# EAGLE schematic DHJSNoiseConsole (EAGLE 7.2.0)
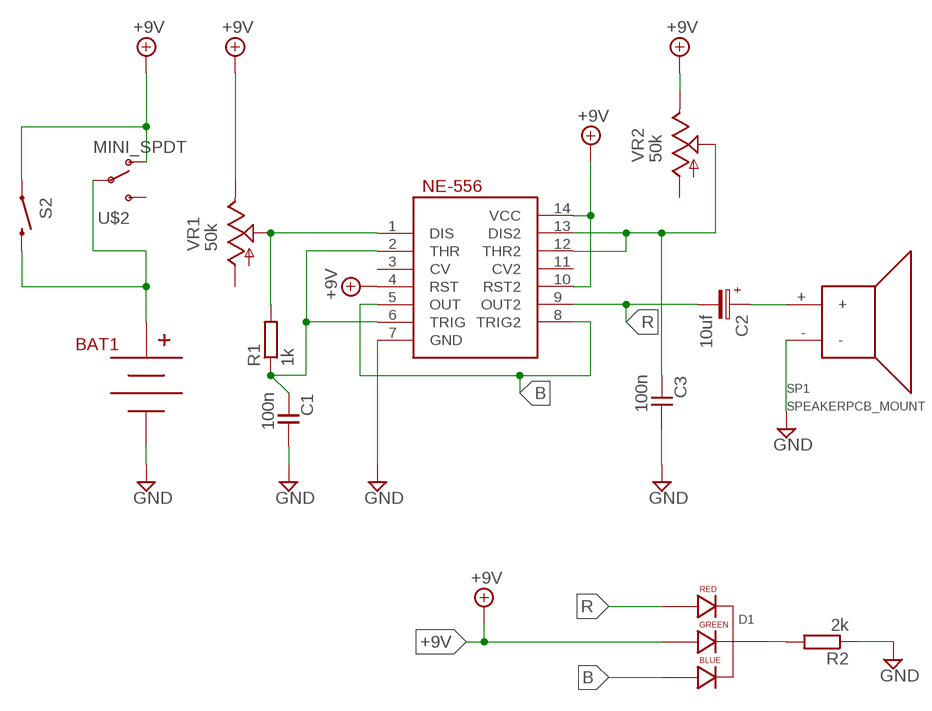
[diagram p0: schematic, sheet 1]

## Parts
BAT1  BC9VPC  [BC9VPC]
C1  100n  C-EU050-024X044  [C050-024X044]
C2  10uf  050-EU  [050_020]
C3  100n  C-EU050-024X044  [C050-024X044]
D1  LED-RGB-CC-THRUCLEAR  [LED-RGB-THRU]
NE-556  556  [DIL14]
R1  1k  RESISTOR10MM_RESISTOR  [10MM_RESISTOR]
R2  2k  RESISTOR10MM_RESISTOR  [10MM_RESISTOR]
S2  SWITCH-MOMENTARY-2SIDE_EZ  [TACTILE-PTH-SIDEEZ]
SP1  SPEAKERPCB_MOUNT  [PCB_MOUNT_SPEAKER]
U$2  MINI_SPDT  [MINI_SPDT_RIGHTANGLE]
VR1  50k  9MM_SNAP-IN_POT_  [9MM_SNAP-IN_POT]
VR2  50k  9MM_SNAP-IN_POT_  [9MM_SNAP-IN_POT]

## Nets
+9V: D1.3(GREEN_CATHODE) NE-556.4(RST) NE-556.10(RST2) NE-556.14(VCC) S2.1 U$2.UP(O) VR1.3(E) VR2.3(E)
B: D1.4(BLUE_CATHODE) NE-556.5(OUT) NE-556.8(TRIG2)
GND: BAT1.V- C1.1 C3.1 NE-556.7(GND) R2.1 SP1.-
N$1: NE-556.1(DIS) R1.2 VR1.2(S)
N$2: BAT1.V+ S2.2 U$2.COMMON
N$3: C3.2 NE-556.12(THR2) NE-556.13(DIS2) VR2.2(S)
N$4: D1.2(CATHODE) R2.2
N$6: C1.2 NE-556.2(THR) NE-556.6(TRIG) R1.1
N$7: C2.+ SP1.+
R: C2.- D1.1(RED_CATHODE) NE-556.9(OUT2)
Unconnected: NE-556.3(CV) NE-556.11(CV2) U$2.DOWN(S) VR1.1(A) VR2.1(A)

## Library data of the parts
BAT1 = SparkFun-Connectors:BC9VPC: 9V board-mount battery cradle; PROD_ID: BATT-10855
C1 C3 = TomW:C-EU: CAPACITOR, European symbol
C2 = gm-caps-electro-pol:050-EU
D1 = SparkFun-LED:LED-RGB-CC-THRU: RGB Through-hole common cathode LED SparkFun Storefront: COM-00105 (Clear) COM-09264 (Diffuse); PROD_ID: DIO-08418
NE-556 = SparkFun-AnalogIC:556: Dual timer circuit (2 555 timers in one package)
R1 R2 = MusicThingModular:RESISTOR: Standard resistor, various versions
S2 = SparkFun-Electromechanical:SWITCH-MOMENTARY-2: Various NO switches- pushbuttons, reed, etc
SP1 = SparkFun-Electromechanical:SPEAKER: General speakers.; MFG: SANCO; PROD_#: NA; SKU: COM-11089; SPARKLE_ID: 6504
U$2 = MusicThingModular:MINI_SPDT
VR1 VR2 = MusicThingModular:9MM_SNAP-IN_POT: 9mm vertical snap-in pot, Alpha / Panasonic style

## Net classes
0 default: width 0.61 mm